# EasyEDA Pro project ProProject_Open Energy Box_2024-07-22.epro, board kradex-PCB-full v2
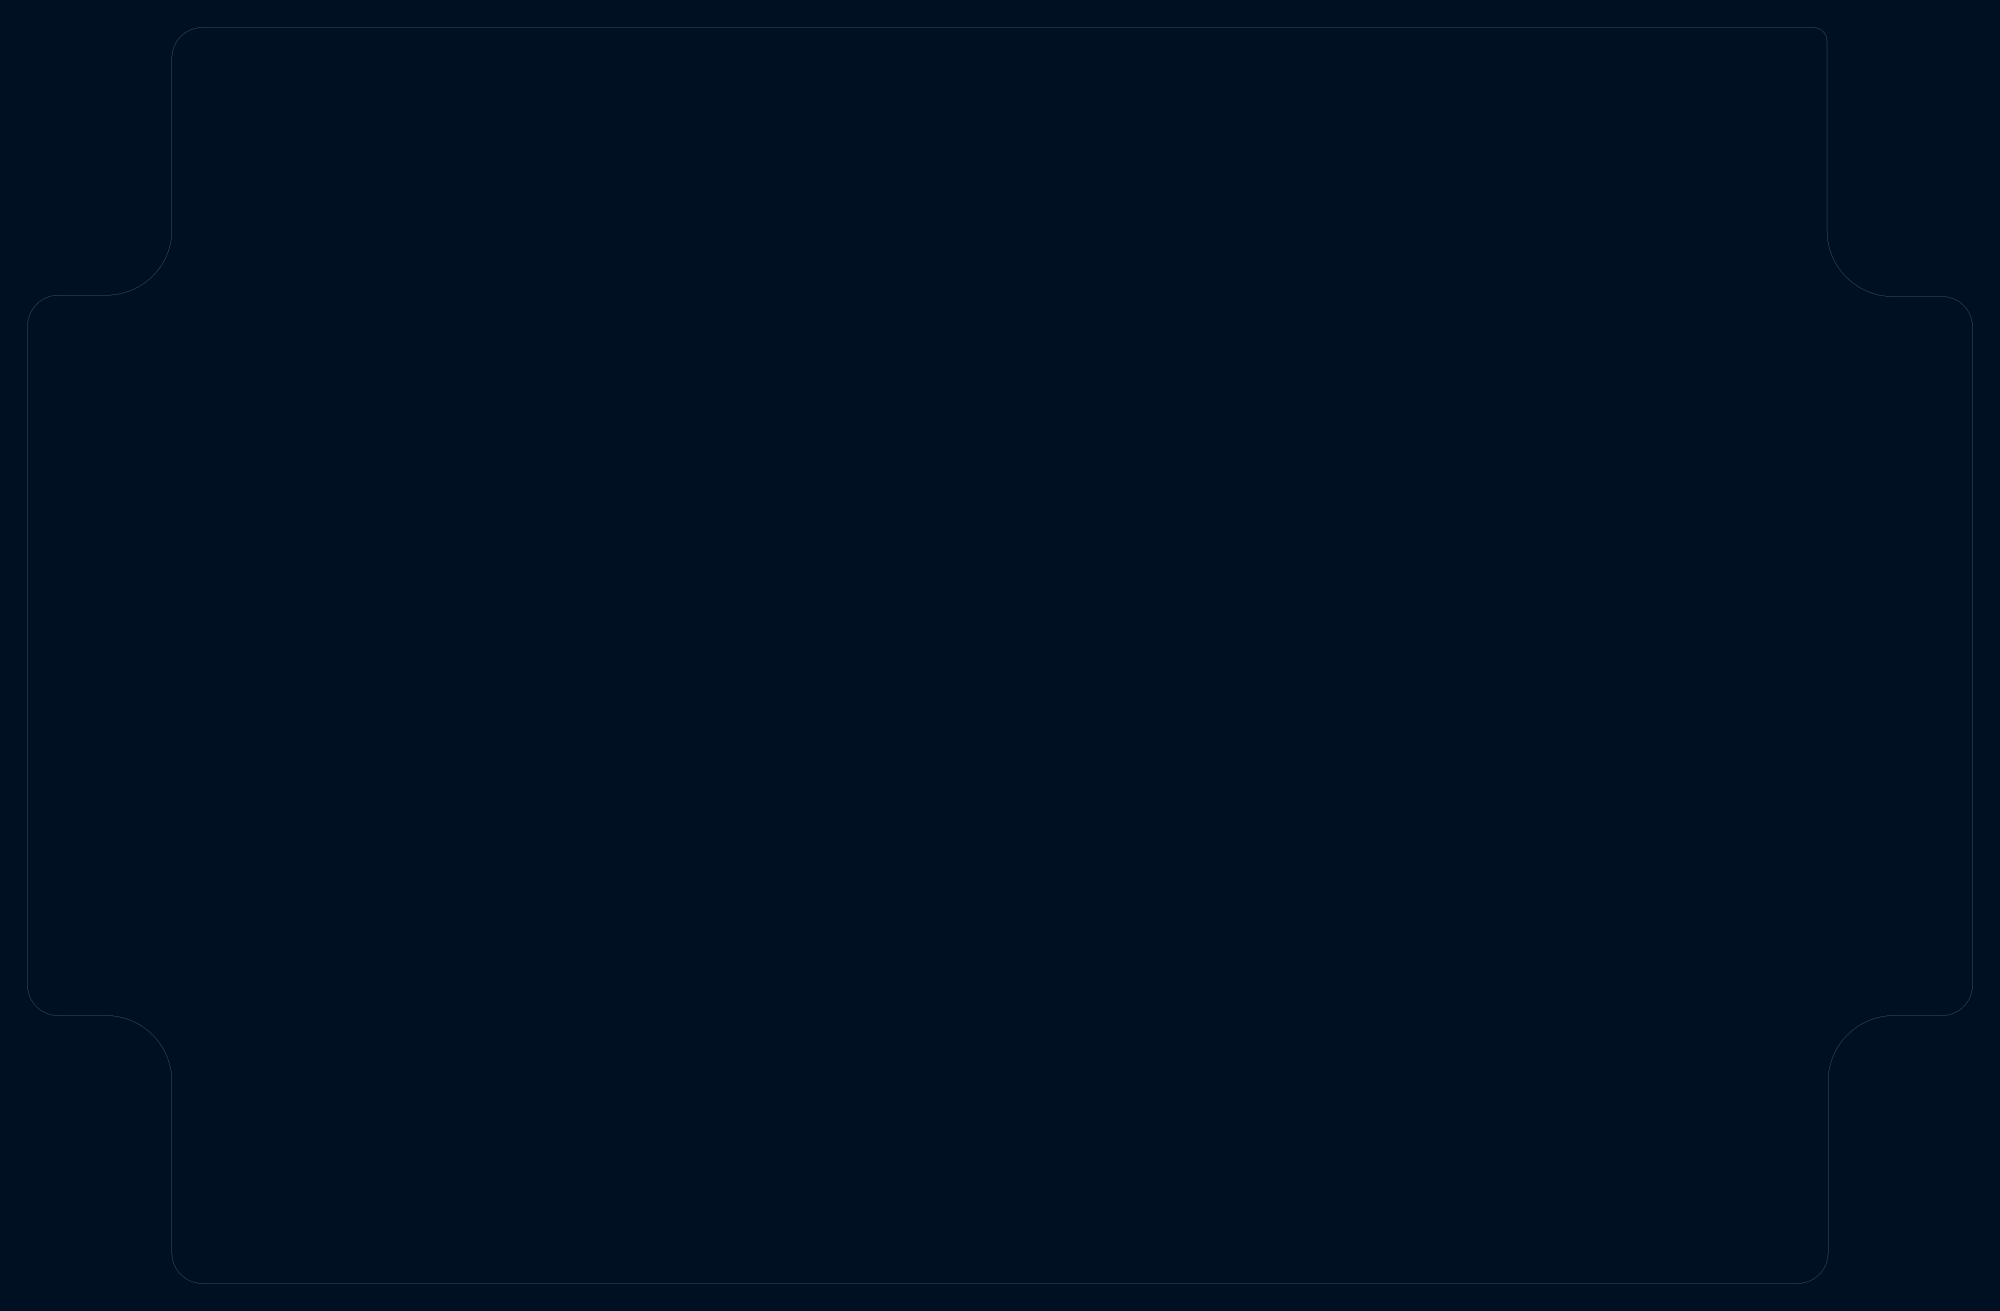
[diagram p14: board, top side]
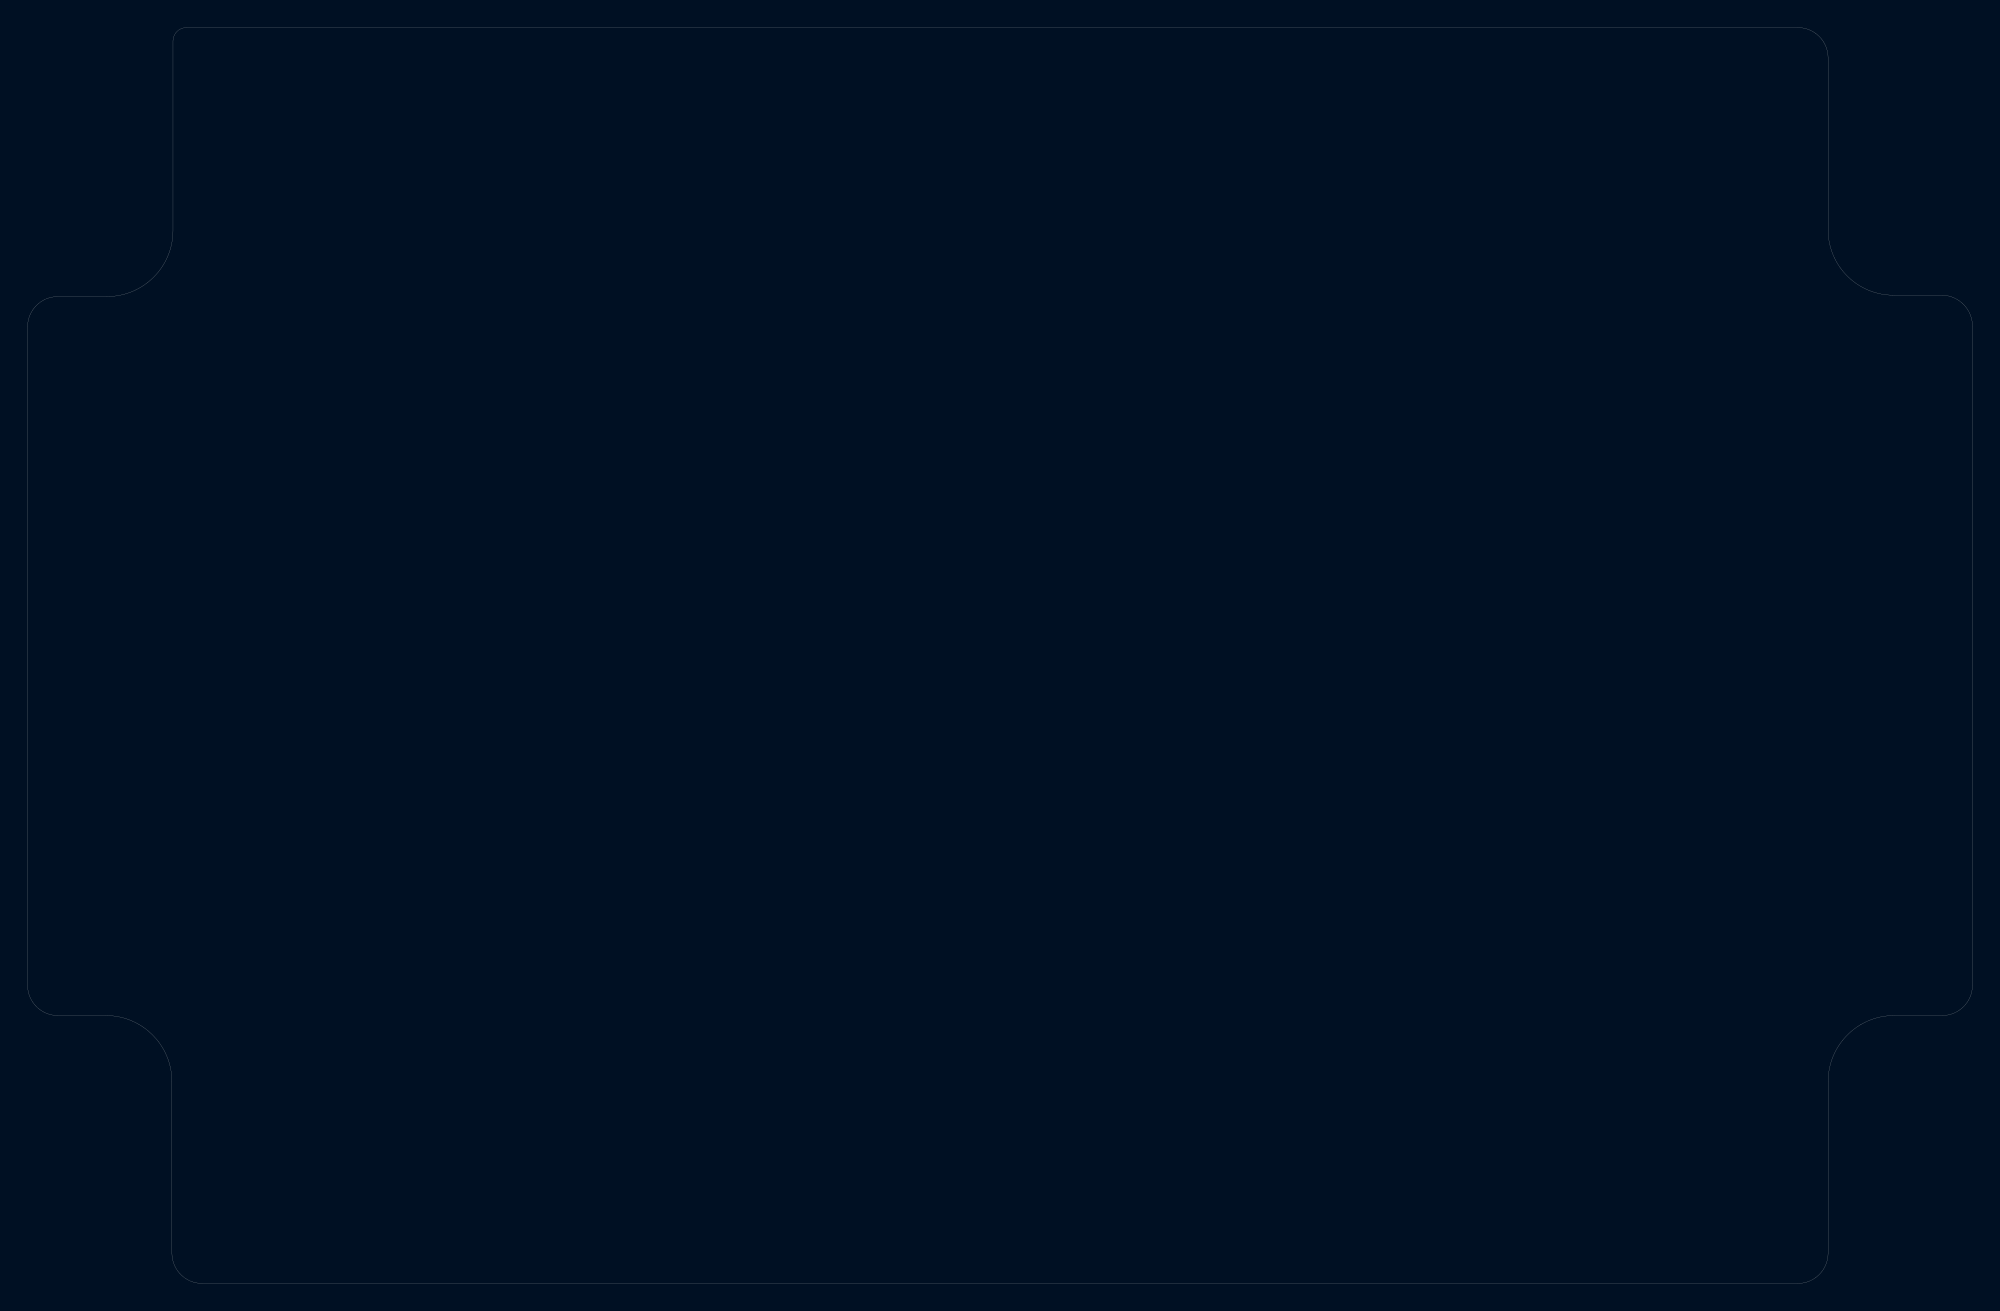
[diagram p15: board, bottom side, seen from below]

Outline 141.16 x 91.16 mm; copper layers: Top Layer, Bottom Layer. Coordinates in mm from the lower left corner of the outline.
Outline path: 0,69.43 0,21.65 arc(0.64,20.09) 2.2,19.45 5.68,19.45 arc(9.07,18.04) 10.48,14.65 10.48,2.2 arc(11.12,0.64) 12.68,0 128.49,0 arc(130.04,0.64) 130.69,2.2 130.69,14.65 arc(132.09,18.04) 135.48,19.45 138.96,19.45 arc(140.52,20.09) 141.16,21.65 141.16,69.43 arc(140.52,70.99) 138.96,71.63 135.41,71.63 arc(132.01,73.04) 130.61,76.43 130.61,90.2 arc(130.3,90.89) 129.6,91.16 12.68,91.16 arc(11.12,90.51) 10.48,88.96 10.48,76.43 arc(9.05,73.09) 5.68,71.73 2.2,71.73 arc(0.62,71.04) 0,69.43

## Placement (name value [footprint] x y rotation side)

## Nets
